# EAGLE design DASH_BOARD (EAGLE 9.1.3)
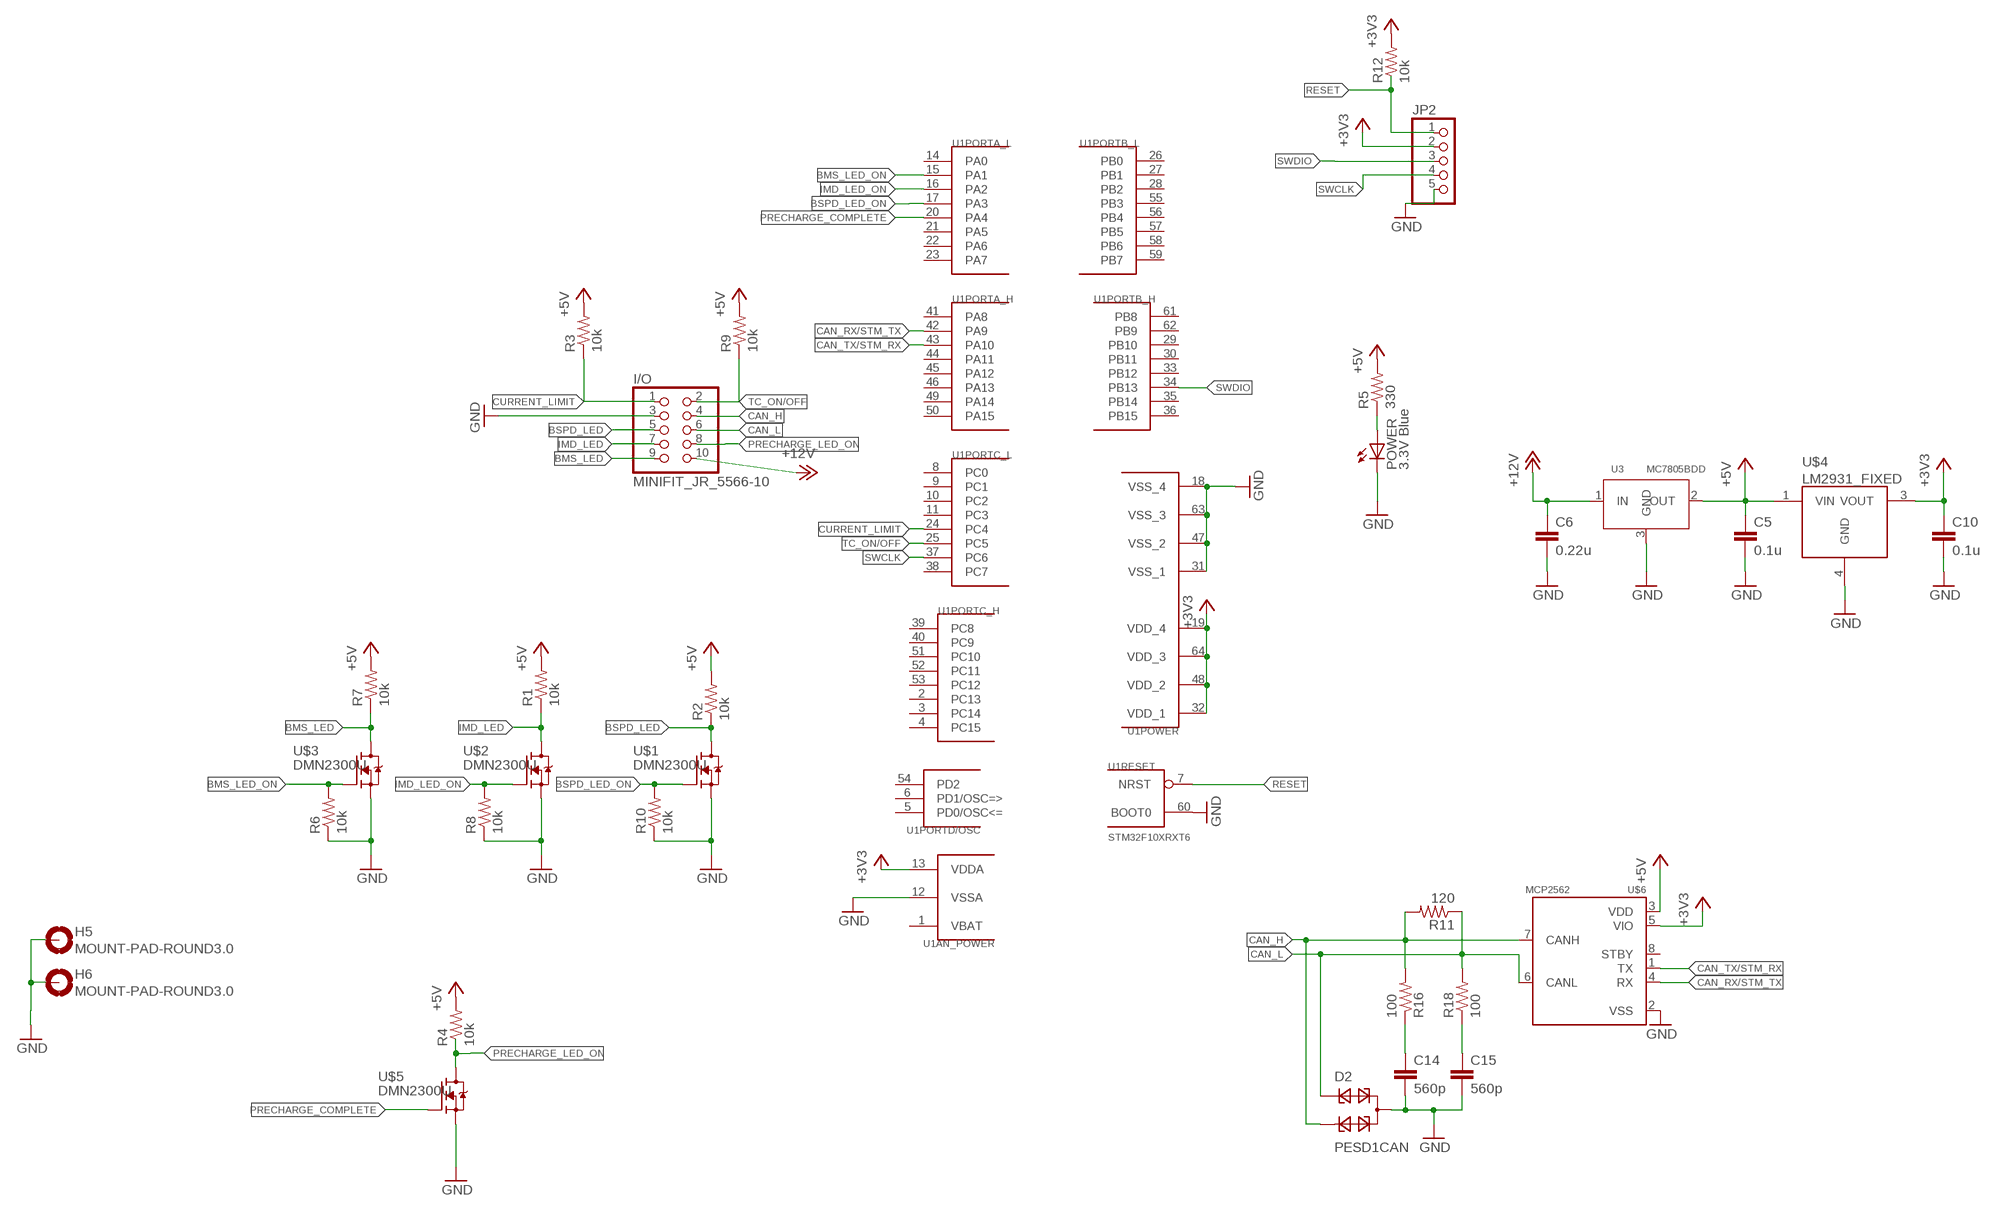
[diagram p0: schematic, sheet 1]

## Parts
C5  0.1u  C-EUC0805K  [C0805K]
C6  0.22u  C-EUC0805K  [C0805K]
C10  0.1u  C-EUC0805K  [C0805K]
C14  560p  C-EUC0805K  [C0805K]
C15  560p  C-EUC0805K  [C0805K]
D2  PESD1CAN  [SOT23]
H5  MOUNT-PAD-ROUND3.0  [3,0-PAD]
H6  MOUNT-PAD-ROUND3.0  [3,0-PAD]
I/O  MINIFIT_JR_5566-10  [MINIFIT_JR_5566-10]
JP2  PINHD-1X5  [1X05]
POWER  3.3V Blue  LEDSML0805  [SML0805]
R1  10k  R-US_R0805  [R0805]
R2  10k  R-US_R0805  [R0805]
R3  10k  R-US_R0805  [R0805]
R4  10k  R-US_R0805  [R0805]
R5  330  R-US_R0805  [R0805]
R6  10k  R-US_R0805  [R0805]
R7  10k  R-US_R0805  [R0805]
R8  10k  R-US_R0805  [R0805]
R9  10k  R-US_R0805  [R0805]
R10  10k  R-US_R0805  [R0805]
R11  120  R-US_R0805  [R0805]
R12  10k  R-US_R0805  [R0805]
R16  100  R-US_R0805  [R0805]
R18  100  R-US_R0805  [R0805]
U1  STM32F10XRXT6  [TQFP64]
U3  MC7805BDD  [DPAK]
U$1  DMN2300U  [SOT23]
U$2  DMN2300U  [SOT23]
U$3  DMN2300U  [SOT23]
U$4  LM2931_FIXED  [DPAK]
U$5  DMN2300U  [SOT23]
U$6  MCP2562  [SOIC8]

## Nets
+3V3: C10.1 JP2.2 R12.2 U1.13(AN_POWER:VDDA) U1.19(POWER:VDD_4) U1.32(POWER:VDD_1) U1.48(POWER:VDD_2) U1.64(POWER:VDD_3) U$4.3(VOUT) U$6.5(VIO)
+5V: C5.1 R1.2 R2.2 R3.2 R4.2 R5.2 R7.2 R9.2 U3.2(OUT) U$4.1(VIN) U$6.3(VDD)
+12V: C6.1 I/O.10 U3.1(IN)
BMS_LED: I/O.9 R7.1 U$3.3(D)
BMS_LED_ON: R6.2 U1.15(PORTA_L:PA1) U$3.1(G)
BSPD_LED: I/O.5 R2.1 U$1.3(D)
BSPD_LED_ON: R10.2 U1.17(PORTA_L:PA3) U$1.1(G)
CAN_H: D2.2 I/O.4 R11.2 R16.2 U$6.7(CANH)
CAN_L: D2.1 I/O.6 R11.1 R18.2 U$6.6(CANL)
CAN_RX/STM_TX: U1.42(PORTA_H:PA9) U$6.4(RX)
CAN_TX/STM_RX: U1.43(PORTA_H:PA10) U$6.1(TX)
CURRENT_LIMIT: I/O.1 R3.1 U1.24(PORTC_L:PC4)
GND: C5.2 C6.2 C10.2 C14.2 C15.2 D2.3 H5.B3,0(MOUNT) H6.B3,0(MOUNT) I/O.3 JP2.5 POWER.C R6.1 R8.1 R10.1 U1.12(AN_POWER:VSSA) U1.18(POWER:VSS_4) U1.31(POWER:VSS_1) U1.47(POWER:VSS_2) U1.60(RESET:BOOT0) U1.63(POWER:VSS_3) U3.3(GND) U$1.2(S) U$2.2(S) U$3.2(S) U$4.4(GND) U$5.2(S) U$6.2(VSS)
IMD_LED: I/O.7 R1.1 U$2.3(D)
IMD_LED_ON: R8.2 U1.16(PORTA_L:PA2) U$2.1(G)
N$1: POWER.A R5.1
N$2 [Digital Signal]: C14.1 R16.1
N$9 [Digital Signal]: C15.1 R18.1
PRECHARGE_COMPLETE: U1.20(PORTA_L:PA4) U$5.1(G)
PRECHARGE_LED_ON: I/O.8 R4.1 U$5.3(D)
RESET: JP2.1 R12.1 U1.7(RESET:NRST)
SWCLK: JP2.4 U1.37(PORTC_L:PC6)
SWDIO: JP2.3 U1.34(PORTB_H:PB13)
TC_ON/OFF: I/O.2 R9.1 U1.25(PORTC_L:PC5)
Unconnected: U1.2(PORTC_H:PC13) U1.3(PORTC_H:PC14) U1.4(PORTC_H:PC15) U1.5(PORTD/OSC:PD0/OSC<=) U1.6(PORTD/OSC:PD1/OSC=>) U1.8(PORTC_L:PC0) U1.9(PORTC_L:PC1) U1.10(PORTC_L:PC2) U1.11(PORTC_L:PC3) U1.14(PORTA_L:PA0) U1.21(PORTA_L:PA5) U1.22(PORTA_L:PA6) U1.23(PORTA_L:PA7) U1.26(PORTB_L:PB0) U1.27(PORTB_L:PB1) U1.28(PORTB_L:PB2) U1.29(PORTB_H:PB10) U1.30(PORTB_H:PB11) U1.33(PORTB_H:PB12) U1.35(PORTB_H:PB14) U1.36(PORTB_H:PB15) U1.38(PORTC_L:PC7) U1.39(PORTC_H:PC8) U1.40(PORTC_H:PC9) U1.41(PORTA_H:PA8) U1.44(PORTA_H:PA11) U1.45(PORTA_H:PA12) U1.46(PORTA_H:PA13) U1.49(PORTA_H:PA14) U1.50(PORTA_H:PA15) U1.51(PORTC_H:PC10) U1.52(PORTC_H:PC11) U1.53(PORTC_H:PC12) U1.54(PORTD/OSC:PD2) U1.55(PORTB_L:PB3) U1.56(PORTB_L:PB4) U1.57(PORTB_L:PB5) U1.58(PORTB_L:PB6) U1.59(PORTB_L:PB7) U1.61(PORTB_H:PB8) U1.62(PORTB_H:PB9) U$6.8(STBY)

## Power pins joined to a net without a drawn wire
VBAT: U1.1(AN_POWER:VBAT)

## Library data of the parts
C5 C6 C10 C14 C15 = rcl:C-EU: CAPACITOR, European symbol
D2 = diode:PESD1CAN: CAN bus ESD protection diode Source: http://www.nxp.com/documents/data_sheet/PESD1CAN.pdf
H5 H6 = holes:MOUNT-PAD-ROUND: MOUNTING PAD, round
I/O = Display_Custom:MINIFIT_JR_5566-10: Molex Minifit JR 5566-10 Vertical 10 position headder https://www.molex.com/pdm_docs/sd/039293026_sd.pdf
JP2 = Headers_IFE:PINHD-1X5: PIN HEADER
POWER = led:LED: LED OSRAM: - CHIPLED LG R971, LG N971, LY N971, LG Q971, LY Q971, LO R971, LY R971 LH N974, LH R974 LS Q976, LO Q976, LY Q976 LO Q996 - Hyper CHIPLED LW Q18S LB Q993, LB Q99A, LB R99A - SideLED LS A670, LO A670, LY A670, LG A670, LP A670 LB A673, LV A673, LT A673, LW A673 LH A674 LY A675 LS A676, LA A676, LO A676, LY A676, LW A676 LS A679, LY A679, LG A679 - Hyper Micro SIDELED® LS Y876, LA Y876, LO Y876, LY Y876 LT Y87S - SmartLED LW L88C, LW L88S LB L89C, LB L89S, LG L890 LS L89K, LO L89K, LY L89K LS L896, LA L896, LO L896, LY L896 - TOPLED LS T670, LO T670, LY T670, LG T670, LP T670 LSG T670, LSP T670, LSY T670, LOP T670, LYG T670 LG T671, LOG T671, LSG T671 LB T673, LV T673, LT T673, LW T673 LH T674 LS T676, LA T676, LO T676, LY T676, LB T676, LH T676, LSB T676, LW T676 LB T67C, LV T67C, LT T67C, LS T67K, LO T67K, LY T67K, LW E67C LS E67B, LA E67B, LO E67B, LY E67B, LB E67C, LV E67C, LT E67C LW T67C LS T679, LY T679, LG T679 LS T770, LO T770, LY T770, LG T770, LP T770 LB T773, LV T773, LT T773, LW T773 LH T774 LS E675, LA E675, LY E675, LS T675 LS T776, LA T776, LO T776, LY T776, LB T776 LHGB T686 LT T68C, LB T68C - Hyper Mini TOPLED® LB M676 - Mini TOPLED Santana® LG M470 LS M47K, LO M47K, LY M47K Source: http://www.osram.convergy.de LUXEON: - LUMILED® LXK2-PW12-R00, LXK2-PW12-S00, LXK2-PW14-U00, LXK2-PW14-V00 LXK2-PM12-R00, LXK2-PM12-S00, LXK2-PM14-U00 LXK2-PE12-Q00, LXK2-PE12-R00, LXK2-PE12-S00, LXK2-PE14-T00, LXK2-PE14-U00 LXK2-PB12-K00, LXK2-PB12-L00, LXK2-PB12-M00, LXK2-PB14-N00, LXK2-PB14-P00, LXK2-PB14-Q00 LXK2-PR12-L00, LXK2-PR12-M00, LXK2-PR14-Q00, LXK2-PR14-R00 LXK2-PD12-Q00, LXK2-PD12-R00, LXK2-PD12-S00 LXK2-PH12-R00, LXK2-PH12-S00 LXK2-PL12-P00, LXK2-PL12-Q00, LXK2-PL12-R00 Source: www.luxeon.com KINGBRIGHT: KA-3528ASYC Source: www.kingbright.com
R1-R4 R6-R10 R12 = resistor:R-US_: RESISTOR, American symbol
R5 R11 R16 R18 = rcl:R-US_: RESISTOR, American symbol
U1 = stm32:STM32F10XRXT6: STM32F101/103 64pin LQFP
U3 = IC's:MC7805BD
U$1-U$3 U$5 = Display_Custom:DMN2300U: 20V N-Channel Mosfet SOT23 https://www.diodes.com/assets/Datasheets/DMN2300U.pdf
U$4 = SparkFun-PowerIC:LM2931_FIXED: LDO regulator with reverse battery protection- very durable!
U$6 = MICROCHIP:MCP2562: MCP2562 High Speed CAN Tranceiver The MCP2561/2 is Microchip Technology Inc. second generation high-speed CAN transceiver. It serves as an interface between a CAN protocol controller and the physical two-wire CAN bus. The device meets the automotive requirements for high-speed (1 Mb/s), low quiescent current, electromagnetic compatibility (EMC) and electrostatic discharge (ESD). The device family members are: • MCP2561 with SPLIT pin • MCP2562 with VIO pin Datasheet <http://ww1.microchip.com/downloads/en/DeviceDoc/20005167C.pdf> Microchip <https://www.microchip.com/wwwproducts/en/MCP2562> Digikey <https://www.digikey.com/product-detail/en/microchip-technology/MCP2562T-E-SN/MCP2562T-E-SNCT-ND/5011025>

## Net classes
1 Digital Signal: width 0.406 mm

## Board
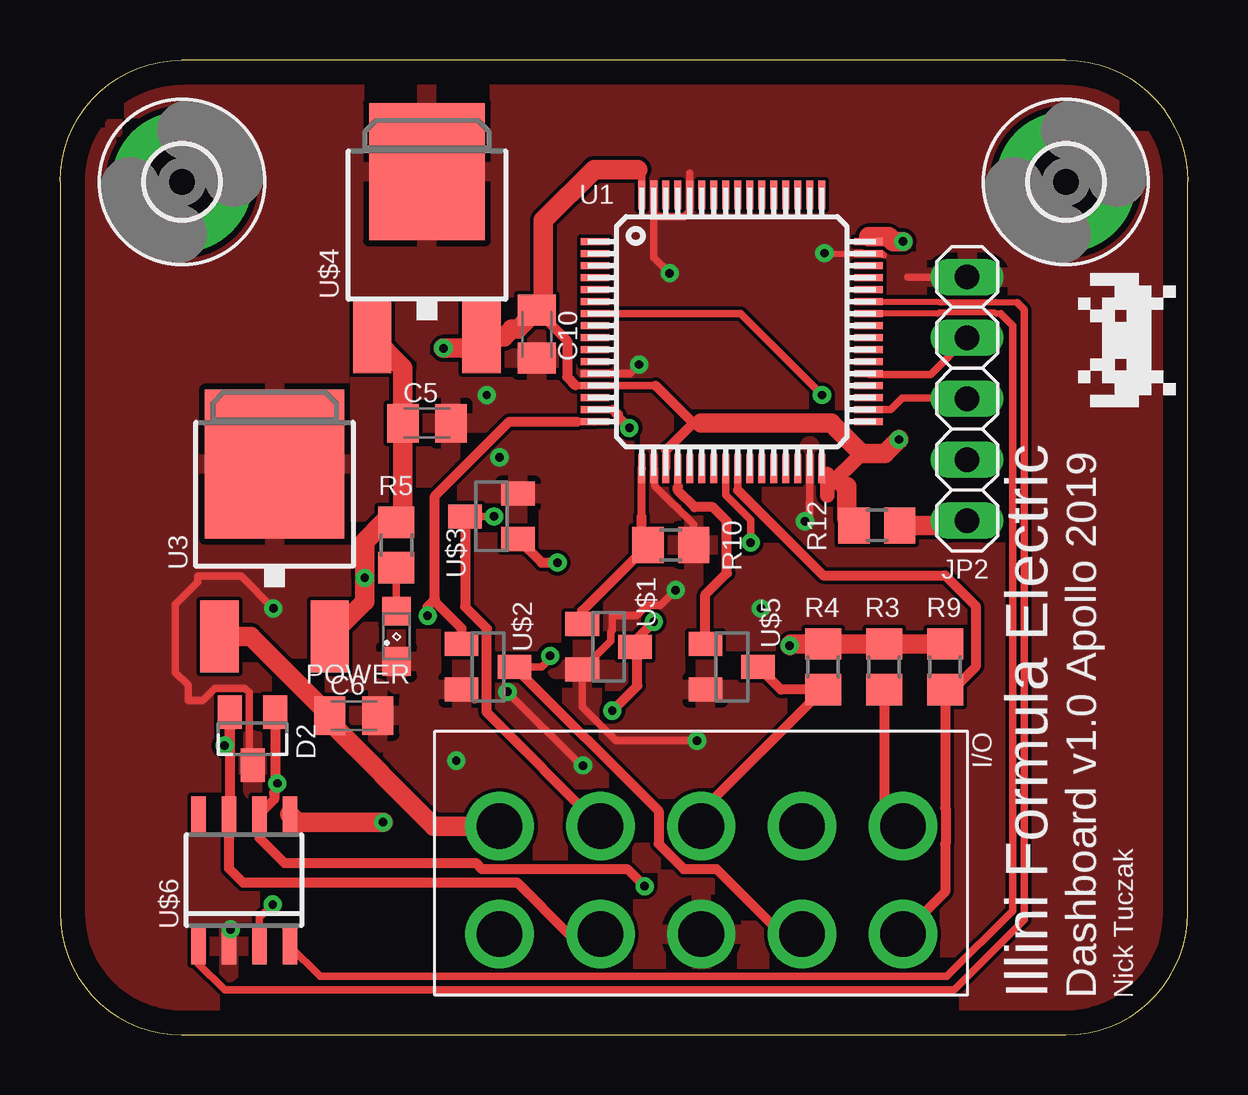
[diagram p1: board, top side]
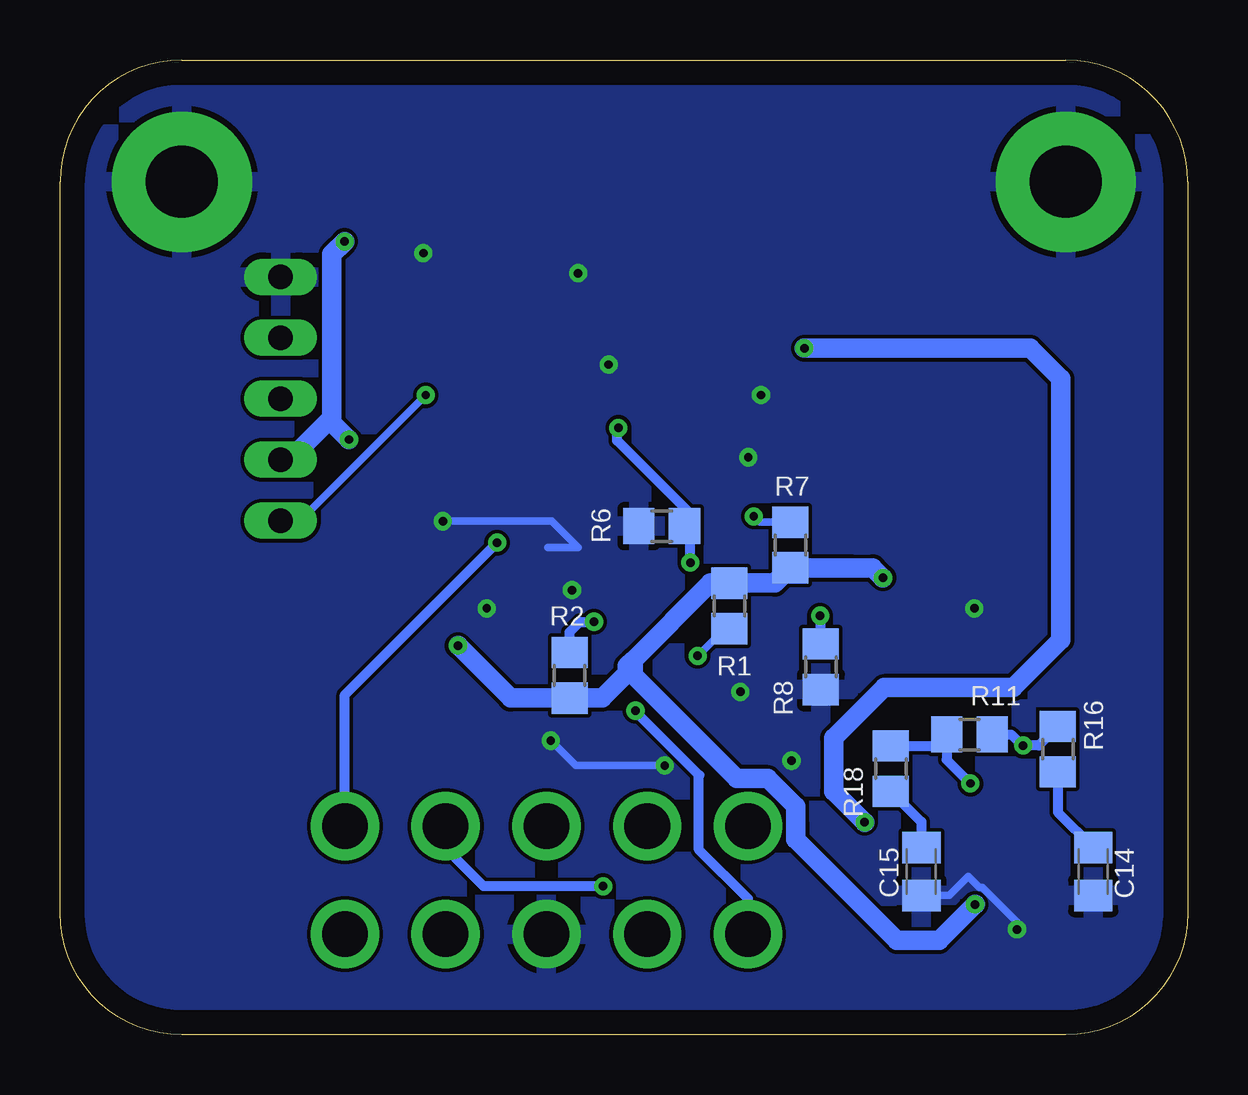
[diagram p2: board, bottom side, seen from below]

Size 46.99 x 40.64 mm. Coordinates in mm from the lower left corner, seen from the top.
Outline: 5.08,0 41.91,0 arc90 46.99,5.08 46.99,35.56 arc90 41.91,40.64 5.08,40.64 arc90 0,35.56 0,5.08 arc90 5.08,0
Copper layers (1*16): Top 0.035mm / dielectric 1.5mm / Bottom 0.035mm
Design rules "default": minimum track width 6mil, minimum drill 0.35mm, track to track 6mil, track to pad 6mil, pad to pad 6mil, via to via 6mil, smd to smd 6mil, copper to edge 40mil, drill to drill 6mil, minimum pad ring 10mil, minimum via ring 8mil, stop-mask expansion 4mil, vias tented up to drill 0mil, thermal gap 10mil

### Footprints (pad centres in the part's own frame; a part is rotated, then mirrored left to right if it is on the bottom)
C0805K = smd 1.3 x 1.6: 1 -1,0; 2 1,0
SOT23 = smd 1 x 1.4: 1 -0.95,-1.1; 2 0.95,-1.1; 3 0,1.1
3,0-PAD = drill 3 pad 5.842: B3,0 0,0
MINIFIT_JR_5566-10 = drill 1.9: 1 -8.4,-2.25; 2 -8.4,2.25; 3 0,2.25; 4 4.2,2.25; 5 8.4,2.25; 6 -4.2,-2.25; 7 -4.2,2.25; 8 0,-2.25; 9 4.2,-2.25; 10 8.4,-2.25
1X05 = drill 1.016 long: 1 -5.08,0; 2 -2.54,0; 3 0,0; 4 2.54,0; 5 5.08,0
SML0805 = smd 1.2 x 1.2: A 1.05,0; C -1.05,0
R0805 = smd 1.3 x 1.5: 1 -0.95,0; 2 0.95,0
TQFP64 = smd 1.2 x 0.3: 1 -5.7,3.75; 2 -5.7,3.25; 3 -5.7,2.75; 4 -5.7,2.25; 5 -5.7,1.75; 6 -5.7,1.25; 7 -5.7,0.75; 8 -5.7,0.25; 9 -5.7,-0.25; 10 -5.7,-0.75; 11 -5.7,-1.25; 12 -5.7,-1.75; 13 -5.7,-2.25; 14 -5.7,-2.75; 15 -5.7,-3.25; 16 -5.7,-3.75; 33 5.7,-3.75; 34 5.7,-3.25; 35 5.7,-2.75; 36 5.7,-2.25; 37 5.7,-1.75; 38 5.7,-1.25; 39 5.7,-0.75; 40 5.7,-0.25; 41 5.7,0.25; 42 5.7,0.75; 43 5.7,1.25; 44 5.7,1.75; 45 5.7,2.25; 46 5.7,2.75; 47 5.7,3.25; 48 5.7,3.75 | smd 0.3 x 1.2: 17 -3.75,-5.7; 18 -3.25,-5.7; 19 -2.75,-5.7; 20 -2.25,-5.7; 21 -1.75,-5.7; 22 -1.25,-5.7; 23 -0.75,-5.7; 24 -0.25,-5.7; 25 0.25,-5.7; 26 0.75,-5.7; 27 1.25,-5.7; 28 1.75,-5.7; 29 2.25,-5.7; 30 2.75,-5.7; 31 3.25,-5.7; 32 3.75,-5.7; 49 3.75,5.7; 50 3.25,5.7; 51 2.75,5.7; 52 2.25,5.7; 53 1.75,5.7; 54 1.25,5.7; 55 0.75,5.7; 56 0.25,5.7; 57 -0.25,5.7; 58 -0.75,5.7; 59 -1.25,5.7; 60 -1.75,5.7; 61 -2.25,5.7; 62 -2.75,5.7; 63 -3.25,5.7; 64 -3.75,5.7
DPAK = smd 3 x 1.6: 1 0,-2.3; 2 0,2.3 | smd 6.2 x 5.8: 3 -7.18,0
DPAK' = smd 1.6 x 3: 1 -2.28,-5.31; 3 2.28,-5.31 | smd 4.826 x 5.715: 4 0,1.588
SOIC8 = smd 0.6 x 1.5: 1 -1.905,-2.75; 2 -0.635,-2.75; 3 0.635,-2.75; 4 1.905,-2.75; 5 1.905,2.75; 6 0.635,2.75; 7 -0.635,2.75; 8 -1.905,2.75

### Placement (x,y rotation side)
C5  15.29,25.5 0 top
C6  12.24,13.31 0 top
C10  19.86,29.21 270 top
C14  3.94,6.81 270 bottom
C15  11.1,6.81 270 bottom
D2  8.03,12.34 180 top
H5  5.08,35.56 0 top
H6  41.91,35.56 0 top
I/O  26.72,6.45 180 top
JP2  37.8,26.52 90 top
POWER  14.02,16.61 90 top
R1  19.1,17.88 90 bottom
R2  25.76,14.99 270 bottom
R3  34.34,15.34 90 top
R4  31.8,15.34 90 top
R5  14.02,20.42 90 top
R6  21.92,21.21 0 bottom
R7  16.56,20.42 270 bottom
R8  15.29,15.34 90 bottom
R9  36.88,15.34 90 top
R10  25.45,20.42 180 top
R11  9.09,12.52 0 bottom
R12  34.04,21.23 180 top
R16  5.41,11.91 90 bottom
R18  12.37,11.1 90 bottom
U1  27.99,29.31 0 top
U3  8.94,16.61 270 top
U$1  22.86,16.18 270 top
U$2  17.83,15.34 270 top
U$3  17.98,21.62 90 top
U$4  LM2931_FIXED  [DPAK']  15.29,34.39 0 top
U$5  27.99,15.34 270 top
U$6  7.67,6.45 0 top

### Tracks (layer width: path | path; a pad name or v marks a point on that pad's centre or on a via)
+3V3  (via drill 0.35)
  Top 0.254: 31.98,22.86 31.74,23.1 U1.32 | 31.98,22.81 32.03,22.86 32.6,22.86
  Top 0.305: 21.49,27.08 21.5,27.06 U1.13 24.82,27.06 | 25.28,24.4 25.28,23.65 U1.19 | 33.69,33.27 U1.48 | U1.64 24.24,35.91 24.08,36.07
  Top 0.406: 26.72,25.5 26.38,25.5 | 26.38,25.5 25.28,24.4 25.24,24.36 | 24.82,27.06 26.38,25.5 | C10.1 21.13,28.94 21.13,27.43 21.49,27.08
  Top 0.61: 33.4,24.23 31.98,22.81 31.98,22.48 31.98,22.86 31.98,23.37 | 32.6,22.86 32.78,22.86
  Top 0.813: 26.72,25.5 32.13,25.5 33.4,24.23 34.37,24.23 v34.95,24.82 | v35.13,33.07 34.72,33.07 34.52,33.27 33.69,33.27 | v15.98,28.63 17.11,28.63 U$4.3 18.49,29.08 18.83,29.42 19.07,29.42 C10.1 20.14,30.49 20.14,33.96 22.25,36.07 24.08,36.07 | v13.46,8.87 9.91,8.87 U$6.5 | 32.78,22.86 32.78,21.54 R12.2
  Bottom 0.813: v35.13,33.07 35.66,32.54 35.66,25.73 | v15.98,28.63 6.55,28.63 5.28,27.36 5.28,16.46 7.26,14.48 12.65,14.48 14.76,12.37 14.76,10.16 v13.46,8.87 | 35.66,25.73 37.41,23.98 JP2.2 | v34.95,24.82 35.66,25.53 35.66,25.73
+5V  (via drill 0.35)
  Top 0.152: R3.2 34.29,16.29
  Top 0.305: v8.87,5.44 8.31,4.88 U$6.3
  Top 0.406: 8.31,3.17 U$6.3
  Top 0.813: U$4.1 14.29,27.8 C5.1 14.29,21.64 R5.2 13.5,21.37 12.7,20.57 v12.7,19.05 12.7,18.07 U3.2 | R9.2 34.29,16.29 R4.2 30.46,16.29 v30.4,16.23
  Bottom 0.813: 14.04,19.47 15.24,19.47 | 15.24,19.47 R7.2 17.2,18.83 R1.2 19.89,18.83 23.11,15.62 | 23.11,15.62 23.36,15.37 23.36,15.08 24.4,14.04 R2.2 28.21,14.04 v30.4,16.23 | 23.11,15.62 23.11,15.01 18.79,10.69 17.5,10.69 16.34,9.52 16.34,8.89 | 16.34,8.23 16.34,8.89 | 15.24,19.47 13.12,19.47 v12.7,19.05 | 16.34,8.89 16.34,8.16 12.12,3.94 10.36,3.94 v8.87,5.44
+12V
  Top 0.813: I/O.10 15.58,8.7 11.24,13.04 C6.1 7.94,16.61 U3.1
BMS_LED  (via drill 0.35)
  Top 0.305: U$3.3 v18.08,21.61
  Top 0.33: U$3.3 16.88,21.59
  Top 0.406: I/O.9 17.79,13.44 17.79,16.94 16.88,17.84 16.88,21.59
  Bottom 0.305: v18.08,21.61 17.84,21.37 R7.1
BMS_LED_ON  (via drill 0.35)
  Top 0.305: U1.15 23.04,26.06
  Top 0.406: 19.33,20.42 U$3.1 20.06,19.68 v20.73,19.68 | v23.72,25.3 23.25,25.78 23.25,25.86 23.04,26.06
  Bottom 0.305: R6.2 20.59,21.59
  Bottom 0.406: 20.59,21.59 23.77,24.77 23.77,25.25 v23.72,25.3 | 20.64,21.54 R6.2 20.73,20.96 v20.73,19.68
BSPD_LED  (via drill 0.35)
  Top 0.406: 24.18,16.18 U$1.3 23.96,16.44 v24.74,17.22 | 24.18,16.18 24.45,16.18 | v23.01,13.51 24.05,14.55 24.05,16.05 24.18,16.18
  Bottom 0.406: I/O.5 18.32,5.67 20.37,7.72 20.37,10.79 20.34,10.82 23.01,13.49 v23.01,13.51 | R2.1 25.76,16.79 25.32,17.22 v24.74,17.22
BSPD_LED_ON
  Top 0.33: 24.23,21.59 U1.17
  Top 0.406: 24.23,21.59 24.23,20.69 R10.2 21.76,17.68 U$1.1
CAN_H  (via drill 0.35)
  Top 0.406: U$6.7 7.04,9.73 | v6.86,12.06 7.08,12.28 D2.2 7.08,9.24 U$6.7 | U$6.7 7.04,6.93 7.62,6.35 19.05,6.35 21.2,4.2 I/O.4
  Bottom 0.406: R11.2 7.36,12.52 6.9,12.06 v6.86,12.06 6.21,12.06 R16.2
CAN_L  (via drill 0.35)
  Top 0.406: D2.1 8.98,10.26 | 8.98,10.26 8.98,10.15 8.92,10.1 8.92,9.82 U$6.6 8.31,8.2 9.35,7.16 17.34,7.16 17.58,6.92 23.64,6.92 v24.36,6.2 | v9.06,10.48 9.06,10.34 8.98,10.26
  Bottom 0.406: R18.2 10.52,12.05 R11.1 10.04,11.47 v9.06,10.48 | v24.36,6.2 29.34,6.2 30.92,7.78 I/O.6
CAN_RX/STM_TX
  Top 0.254: 39.2,30.06 39.03,30.06 38.99,30.1 36.6,30.1 36.56,30.06 U1.42
  Top 0.305: 39.2,30.06 39.7,29.57 39.7,5.18 36.96,2.44 10.84,2.44 U$6.4
CAN_TX/STM_RX
  Top 0.254: U1.43 36.6,30.56 38.99,30.56 | 38.99,30.56 | 38.99,30.56 39.85,30.56 39.89,30.52
  Top 0.305: U$6.1 5.77,2.97 6.86,1.88 37.26,1.88 40.18,4.8 40.18,30.23 39.89,30.52
CURRENT_LIMIT  (via drill 0.35)
  Top 0.152: U1.24
  Top 0.305: v28.78,20.52 28.78,21.46 27.73,22.5 27.73,22.96 U1.24
  Top 0.406: R3.1 34.34,9.48 I/O.1
  Bottom 0.406: I/O.1 35.12,14.18 v28.78,20.52
GND  (via drill 0.35)
  Top 0.254: U1.47 33.83,32.56 | 33.83,32.56 34.26,32.56 34.33,32.49 | v31.85,32.59 31.88,32.56 33.83,32.56
  Top 0.305: 26.24,35.87 26.24,34.33 26.02,34.11 24.79,34.11 24.71,34.04 24.74,34.06 U1.63 24.74,32.41 v25.4,31.75 | 26.24,35.87 26.24,35.92 26.24,35.87 | 26.24,35.87 26.24,35.86 U1.60 | U1.12 23.75,27.56 v24.13,27.94 | v25.65,18.54 25.02,17.9 24.46,17.9 24.03,17.48 23.01,17.48 23.01,16.86 22.95,16.81 22.95,16.43 U$1.2 21.76,13.67 23.16,12.27 v26.54,12.27 | D2.3 7.88,11.39 7.88,14.27 7.7,14.45 6.45,14.45 5.94,13.94 5.33,13.94 5.33,14.58 4.8,15.11 4.8,17.93 5.74,18.87 5.74,19.13 7.54,19.13 v8.89,17.78 | 31.24,21.61 v31.04,21.41 | U$2.2 17.28,14.39 17.28,13.97 | v21.79,11.23 21.71,11.23 v18.64,14.3 | v31.04,21.41 31.24,21.61 | 31.24,21.61 31.24,22.86 | 31.24,22.86 31.24,23.25 U1.31 31.24,22.2 31.22,22.17 31.22,21.59 v31.04,21.41 | 35.33,31.6 JP2.5 | U1.31 31.24,22.86 | U1.18 24.78,23.57 24.78,22.89 26.4,21.27 R10.1 | v7.11,4.39 7.11,3.78 U$6.2
  Bottom 0.305: v31.04,21.41 26.49,21.41 25.4,20.32 26.67,20.32 | v26.54,12.27 25.5,11.23 v21.79,11.23 | C15.2 9.94,5.81 9.14,6.6 8.69,6.15 8.57,6.15 7.11,4.69 v7.11,4.39
  other vias: 18.31,24.08 29.21,17.78 16.51,11.43 17.78,26.67
  pour Bottom: 0,40.64 0,0 46.99,0 46.99,40.64
  pour Top: 0,40.64 0,0 46.99,0 46.99,40.64
IMD_LED  (via drill 0.35)
  Top 0.305: U$2.3 20.07,15.34 20.42,15.7 v20.42,15.8
  Top 0.406: I/O.7 30.07,4.2 27.35,6.92 25.98,6.92 24.94,7.96 24.94,9.33 U$2.3
  Bottom 0.305: v20.42,15.8 19.44,16.78 19.44,16.93
  Bottom 0.406: 19.44,16.93 R1.1
IMD_LED_ON  (via drill 0.35)
  Top 0.305: U$2.1 16.56,16.29 | U1.16 21.54,25.56
  Top 0.406: U$2.1 16.73,16.95 15.57,18.11 | 15.57,18.11 15.62,18.16 15.62,22.45 18.73,25.56 21.54,25.56 | v15.32,17.48 15.32,17.86 15.57,18.11
  Bottom 0.406: R8.2 15.29,17.45 v15.32,17.48
N$1
  Top 0.305: R5.1 POWER.A
N$2
  Bottom 0.406: R16.1 5.41,9.28 C14.1
N$9
  Bottom 0.406: R18.1 11.1,8.88 C15.1
PRECHARGE_COMPLETE
  Top 0.305: 25.74,22.86 U1.20
  Top 0.406: U$5.1 26.89,18.36 27.79,19.25 27.79,21.41 27.2,22 26.44,22 25.74,22.7 25.74,22.86
PRECHARGE_LED_ON
  Top 0.406: 31.64,14.23 26.72,9.31 I/O.8 | R4.1 30.04,14.39 U$5.3
  Top 0.813: R4.1 31.64,14.23
RESET  (via drill 0.35)
  Top 0.305: U1.7 28.36,30.06 v31.75,26.67
  Top 0.813: R12.1 37.59,21.23 JP2.1
  Bottom 0.305: v31.75,26.67 36.98,21.44 JP2.1
SWCLK
  Top 0.305: U1.37 33.72,27.53 35.56,27.53 36.27,27.53 JP2.4
SWDIO
  Top 0.305: U1.34 34.62,26.06 35.1,26.54 37.77,26.54 JP2.3
TC_ON/OFF
  Top 0.305: 28.24,22.71 U1.25
  Top 0.406: R9.1 36.88,14.07 | 36.88,14.07 36.88,9.46 36.9,9.44 36.9,7.96 36.88,7.94 36.88,5.96 I/O.2 | 36.88,14.07 38.15,15.34 38.15,17.88 36.88,19.15 31.8,19.15 28.24,22.71

### Text on the board
tNames: Illini Formula Electric | Dashboard v1.0 Apollo 2019 | Nick Tuczak